# EAGLE design right_revision2_0 (EAGLE 7.2.0)
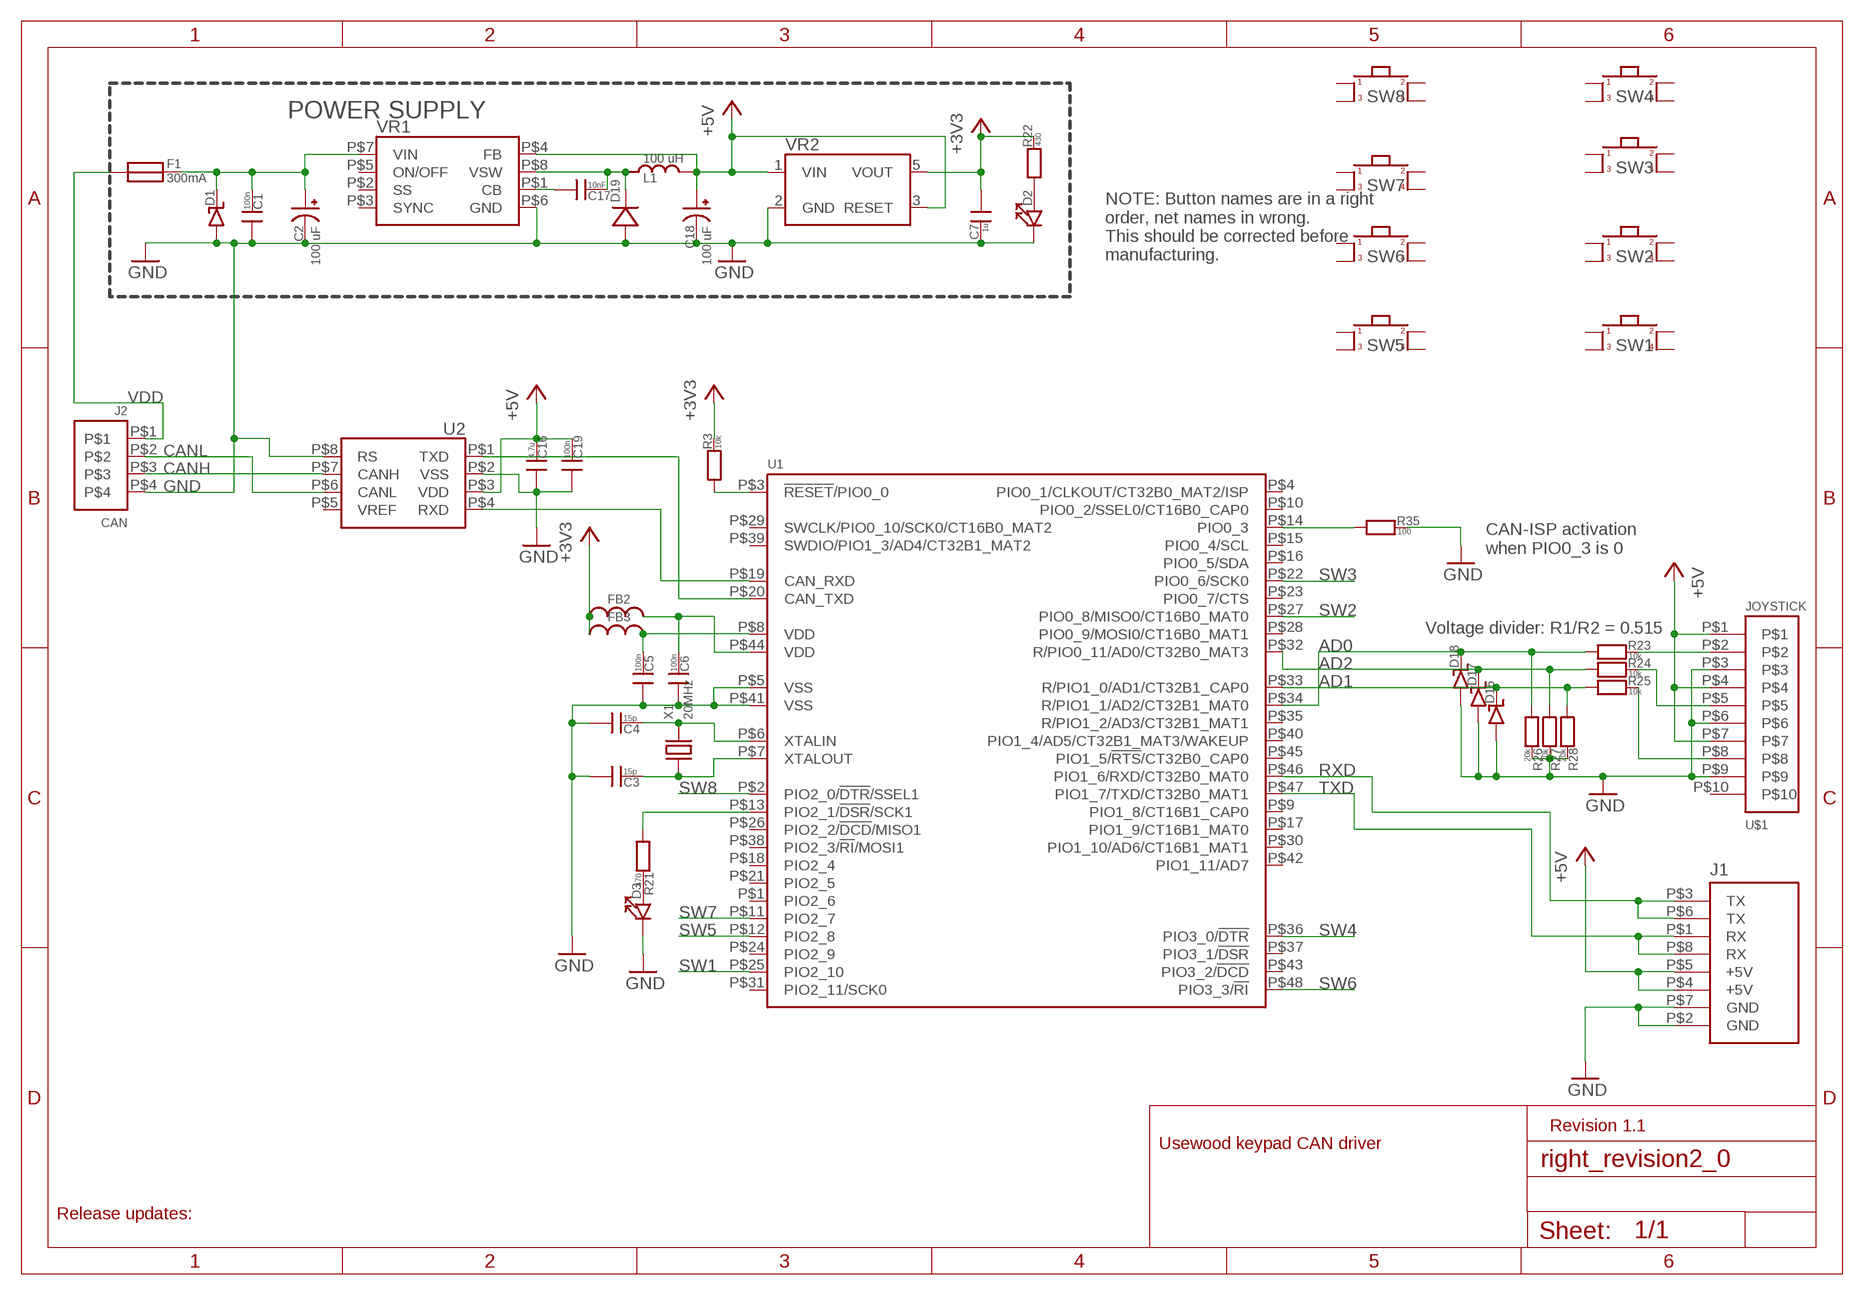
[diagram p0: schematic, sheet 1]

## Parts
C1  100n  CAP0603_SILKSCREEN  [0603_SILKSCREEN]
C2  100 uF  CAP_POLSMD_10X10X10MM  [CAP_POL_SMD_10X10X10MM]
C3  15p  CAP0603_SILKSCREEN  [0603_SILKSCREEN]
C4  15p  CAP0603_SILKSCREEN  [0603_SILKSCREEN]
C5  100n  CAP0603_SILKSCREEN  [0603_SILKSCREEN]
C6  100n  CAP0603_SILKSCREEN  [0603_SILKSCREEN]
C7  1u  CAP0603_SILKSCREEN  [0603_SILKSCREEN]
C16  4.7u  CAP0603_SILKSCREEN  [0603_SILKSCREEN]
C17  10nF  CAP0603_SILKSCREEN  [0603_SILKSCREEN]
C18  100 uF  CAP_POLSMD_10X10X10MM  [CAP_POL_SMD_10X10X10MM]
C19  100n  CAP0603_SILKSCREEN  [0603_SILKSCREEN]
D1  DIODE_TVSDO-214AA  [DO-214AB]
D2  LED0603_SILKSCREEN  [0603_SILKSCREEN]
D3  LED0603_SILKSCREEN  [0603_SILKSCREEN]
D16  DIODE_ZENERSDO123  [SOD123]
D17  DIODE_ZENERSDO123  [SOD123]
D18  DIODE_ZENERSDO123  [SOD123]
D19  DIODEDO219AB  [DO219AB]
F1  300mA  FUSE100MA  [FUSE_100MA]
FB2  FERRITE0603_SILKSCREEN  [0603_SILKSCREEN]
FB3  FERRITE0603_SILKSCREEN  [0603_SILKSCREEN]
J1  HEADER_USART_2_TH  [HEADER_USART_2_TH]
J2  CAN  MOLEX_MICRO-FIT_4WAYTH  [MOLEX_MICRO-FIT_4WAY]
L1  100 uH  INDUCTORBOURNS_10X13X5MM  [INDUCTOR_BOURNS_10X13X5MM]
R3  10k  RES0604_SILKSCREEN  [0603_SILKSCREEN]
R21  470  RES0604_SILKSCREEN  [0603_SILKSCREEN]
R22  430  RES0604_SILKSCREEN  [0603_SILKSCREEN]
R23  10k  RES0604_SILKSCREEN  [0603_SILKSCREEN]
R24  10k  RES0604_SILKSCREEN  [0603_SILKSCREEN]
R25  10k  RES0604_SILKSCREEN  [0603_SILKSCREEN]
R26  20k  RES0604_SILKSCREEN  [0603_SILKSCREEN]
R27  20k  RES0604_SILKSCREEN  [0603_SILKSCREEN]
R28  20k  RES0604_SILKSCREEN  [0603_SILKSCREEN]
R35  100  RES0604_SILKSCREEN  [0603_SILKSCREEN]
SW1  SWITCH_EVQP6L  [SWITCH_EVQ9P6B40]
SW2  SWITCH_EVQP6L  [SWITCH_EVQ9P6B40]
SW3  SWITCH_EVQP6L  [SWITCH_EVQ9P6B40]
SW4  SWITCH_EVQP6L  [SWITCH_EVQ9P6B40]
SW5  SWITCH_EVQP6L  [SWITCH_EVQ9P6B40]
SW6  SWITCH_EVQP6L  [SWITCH_EVQ9P6B40]
SW7  SWITCH_EVQP6L  [SWITCH_EVQ9P6B40]
SW8  SWITCH_EVQP6L  [SWITCH_EVQ9P6B40]
U1  LPC11C14_QFP48  [QFP48]
U2  MCP2551_SOIC8  [SOIC8]
U$1  JOYSTICK  MOLEX_MICRO-FIT_10WAYTH  [MOLEX-MICRO-FIT_10WAY]
VR1  LM2671SOIC8  [SOIC8]
VR2  LP2985SOP5  [SOP5]
X1  20MHz  XTALSMD_5X3.2  [XTAL_SMD_5X3.2]

## Nets
+3V3: C7.0 FB2.0 FB3.0 R3.1 R22.1 VR2.5(VOUT)
+5V: C16.1 C18.+ C19.1 J1.P$4(+5V) J1.P$5(+5V) L1.P$2 U2.P$3(VDD) U$1.P$1 U$1.P$4 U$1.P$7 VR1.P$4(FB) VR2.1(VIN) VR2.3(RESET)
AD0: D18.P$2(N) R23.0 R26.0 U1.P$34(R/PIO1_1/AD2/CT32B1_MAT0)
AD1: D16.P$2(N) R25.0 R28.0 U1.P$33(R/PIO1_0/AD1/CT32B1_CAP0)
AD2: D17.P$2(N) R24.0 R27.0 U1.P$32(R/PIO0_11/AD0/CT32B0_MAT3)
CAN_ISP: R35.0 U1.P$14(PIO0_3)
CANH: J2.P$3 U2.P$7(CANH)
CANL: J2.P$2 U2.P$6(CANL)
GND: C1.0 C2.- C3.0 C4.0 C5.0 C6.0 C7.1 C16.0 C18.- C19.0 D1.P$1(P) D2.1 D3.1 D16.P$1(P) D17.P$1(P) D18.P$1(P) D19.P$1(P) J1.P$2(GND) J1.P$7(GND) J2.P$4 R26.1 R27.1 R28.1 R35.1 U1.P$5(VSS) U1.P$41(VSS) U2.P$2(VSS) U2.P$8(RS) U$1.P$3 U$1.P$6 U$1.P$9 VR1.P$6(GND) VR2.2(GND)
LED3: D3.0 R21.1
N$1: C1.1 C2.+ D1.P$2(N) F1.P$2 VR1.P$7(VIN)
N$2: C6.1 FB2.1 U1.P$44(VDD)
N$3: D2.0 R22.0
N$4: C17.1 D19.P$2(N) L1.P$1 VR1.P$8(VSW)
N$5: R21.0 U1.P$13(PIO2_1/!DSR!/SCK1)
N$20: U1.P$20(CAN_TXD) U2.P$1(TXD)
N$21: U1.P$19(CAN_RXD) U2.P$4(RXD)
N$26: C5.1 FB3.1 U1.P$8(VDD)
N$27: C17.0 VR1.P$1(CB)
N$28: C3.1 U1.P$7(XTALOUT) X1.P$1
RESET: R3.0 U1.P$3(!RESET!/PIO0_0)
RXD: J1.P$3(TX) J1.P$6(TX) U1.P$46(PIO1_6/RXD/CT32B0_MAT0)
SW1: U1.P$25(PIO2_10)
SW2: U1.P$27(PIO0_8/MISO0/CT16B0_MAT0)
SW3: U1.P$22(PIO0_6/SCK0)
SW4: U1.P$36(PIO3_0/!DTR)
SW5: U1.P$12(PIO2_8)
SW6: U1.P$48(PIO3_3/!RI)
SW7: U1.P$11(PIO2_7)
SW8: U1.P$2(PIO2_0/!DTR!/SSEL1)
TXD: J1.P$1(RX) J1.P$8(RX) U1.P$47(PIO1_7/TXD/CT32B0_MAT1)
VDD: F1.P$1 J2.P$1
XJOY: R23.1 U$1.P$2
XTALIN: C4.1 U1.P$6(XTALIN) X1.P$2
YJOY: R24.1 U$1.P$5
ZJOY: R25.1 U$1.P$8
Unconnected: SW1.A SW1.A' SW1.B SW1.B' SW2.A SW2.A' SW2.B SW2.B' SW3.A SW3.A' SW3.B SW3.B' SW4.A SW4.A' SW4.B SW4.B' SW5.A SW5.A' SW5.B SW5.B' SW6.A SW6.A' SW6.B SW6.B' SW7.A SW7.A' SW7.B SW7.B' SW8.A SW8.A' SW8.B SW8.B' U1.P$1(PIO2_6) U1.P$4(PIO0_1/CLKOUT/CT32B0_MAT2/ISP) U1.P$9(PIO1_8/CT16B1_CAP0) U1.P$10(PIO0_2/SSEL0/CT16B0_CAP0) U1.P$15(PIO0_4/SCL) U1.P$16(PIO0_5/SDA) U1.P$17(PIO1_9/CT16B1_MAT0) U1.P$18(PIO2_4) U1.P$21(PIO2_5) U1.P$23(PIO0_7/CTS) U1.P$24(PIO2_9) U1.P$26(PIO2_2/!DCD!/MISO1) U1.P$28(PIO0_9/MOSI0/CT16B0_MAT1) U1.P$29(SWCLK/PIO0_10/SCK0/CT16B0_MAT2) U1.P$30(PIO1_10/AD6/CT16B1_MAT1) U1.P$31(PIO2_11/SCK0) U1.P$35(R/PIO1_2/AD3/CT32B1_MAT1) U1.P$37(PIO3_1/!DSR) U1.P$38(PIO2_3/!RI!/MOSI1) U1.P$39(SWDIO/PIO1_3/AD4/CT32B1_MAT2) U1.P$40(PIO1_4/AD5/CT32B1_MAT3/WAKEUP) U1.P$42(PIO1_11/AD7) U1.P$43(PIO3_2/!DCD) U1.P$45(PIO1_5/!RTS!/CT32B0_CAP0) U2.P$5(VREF) U$1.P$10 VR1.P$2(SS) VR1.P$3(SYNC) VR1.P$5(ON/OFF)

## Notes on the sheet
- POWER SUPPLY
- NOTE: Button names are in a right 
  order, net names in wrong.
  This should be corrected before
  manufacturing.
- CAN-ISP activation 
  when PIO0_3 is 0
- Voltage divider: R1/R2 = 0.515
- Revision 1.1
- Usewood keypad CAN driver
- Release updates:

## Library data of the parts
C1 C3-C7 C16 C17 C19 = usevolt:CAP
C2 C18 = usevolt:CAP_POL
D1 = arm:DIODE_TVS: 9886257 STMICROELECTRONICS SMBJ33A-TR Product Range:Transil SMBJ Series; TVS Polarity:Unidirectional; Reverse Stand-Off Voltage Vrwm:33V; Diode Case Style:DO-214AA; No. of Pins:2; Breakdown Voltage Min:36.7V; Breakdown Voltage Max:38.6 http://fi.farnell.com/webapp/wcs/stores/servlet/ProductDisplay?catalogId=15001&langId=358&urlRequestType=Base&partNumber=9886257&storeId=10159
D2 D3 = usevolt:LED
D16-D18 = usevolt:DIODE_ZENER
D19 = usevolt:DIODE
F1 = arm:FUSE: *** 100 mA *** 1861161 MULTICOMP MC36204 Holding Current:100mA; Tripping Current:300mA; Carrying Current Max:10A; Initial Resistance Max:15ohm; Operating Voltage:60VDC; PTC Fuse Case Style:SMD; Current Max:10A; External Depth:3 http://fi.farnell.com/webapp/wcs/stores/servlet/ProductDisplay?catalogId=15001&langId=358&urlRequestType=Base&partNumber=1861161&storeId=10159
FB2 FB3 = usevolt:FERRITE
J1 = usevolt:HEADER_USART_2
J2 = arm:MOLEX_MICRO-FIT_4WAY: MOLEX 43045-0401 HEADER, RIGHT ANGLE, DUAL ROW, 4 WAY, 1704306 Product Range:Micro-Fit 3.0 43045 Series; Pitch Spacing:3mm; Contact Termination Type:Through Hole; No. of Contacts:4; No. of Rows:2; Connector Mounting:PCB; Gender:Header; Contact M http://fi.farnell.com/webapp/wcs/stores/servlet/ProductDisplay?catalogId=15001&langId=358&urlRequestType=Base&partNumber=1704306&storeId=10159
L1 = usevolt:INDUCTOR
R3 R21-R28 R35 = usevolt:RES
SW1-SW8 = usevolt:SWITCH_EVQP6L: http://www.farnell.com/datasheets/1679727.pdf PANASONIC ELECTRONIC COMPONENTS EVQ9P6B40 SWITCH, 4X4MM, 2.4N Lisää suosikkeihin Huomasitko virheen? Tulosta sivu PANASONIC ELECTRONIC COMPONENTS EVQ9P6B40 Suurenna napsauttamalla Kuva on vain kuvaavaa tarkoitusta varten. Lue tuotekuvaus tarkempia tietoja varten. PANASONIC ELECTRONIC COMPONENTS Valmistaja PANASONIC ELECTRONIC COMPONENTS Tilauskoodi: 2079573 Valmistajan osanumero EVQ9P6B40 Technical Data Sheet (124.82KB) EN Tuotetiedot, asiakirjat ja muuta Contact Current Max: 20mA Contact Voltage DC Nom: 15V Illumination: Non Illuminated Operating Force: 2.4N Product Range: - SVHC: No SVHC (15-Jun-2015) Switch Terminals: Solder; FARNELL_ID: 2079541; MANUFACTURER_ID: EVQ-P6LB55; MOUSER_ID: 667-EVQ-P6LB55
U1 = usevolt:LPC11C14
U2 = usevolt:MCP2551: Microchip High-Speed CAN Transceiver Supports 1 Mb/s operation • Implements ISO-11898 standard physical layer requirements • Suitable for 12V and 24V systems • Externally-controlled slope for reduced RFI emissions • Detection of ground fault (permanent dominant) on TXD input • Power-on reset and voltage brown-out protection • An unpowered node or brown-out event will not disturb the CAN bus • Low current standby operation • Protection against damage due to short-circuit conditions (positive or negative battery voltage) • Protection against high-voltage transients • Automatic thermal shutdown protection • Up to 112 nodes can be connected • High noise immunity due to differential bus implementation • Temperature ranges: - Industrial (I): -40°C to +85°C - Extended (E): -40°C to +125°C http://www.digikey.com/product-detail/en/MCP2551T-E%2FSN/MCP2551T-E%2FSNCT-ND/4307904 http://ww1.microchip.com/downloads/en/DeviceDoc/21667f.pdf http://www.farnell.com/datasheets/657417.pdf http://fi.farnell.com/microchip/mcp2551-i-sn/ic-can-transceiver-hi-speed-smd/dp/9758569
U$1 = usevolt:MOLEX_MICRO-FIT_10WAY: MOLEX HEADER, MICRO-FIT, R/A, DUAL ROW, 10 WAY, 1012255
VR1 = usevolt:LM2671: TEXAS INSTRUMENTS LM2671MX-5.0/NOPB IC, STEP-DOWN REGULATOR, SOIC-8 http://www.farnell.com/datasheets/1874686.pdf
VR2 = arm:LP2985: TEXAS INSTRUMENTS LP2985IM5-3.3 V REG LDO +3.3V, SMD, 2985, SOT235 http://www.farnell.com/datasheets/1882537.pdf
X1 = arm:XTAL

## Board
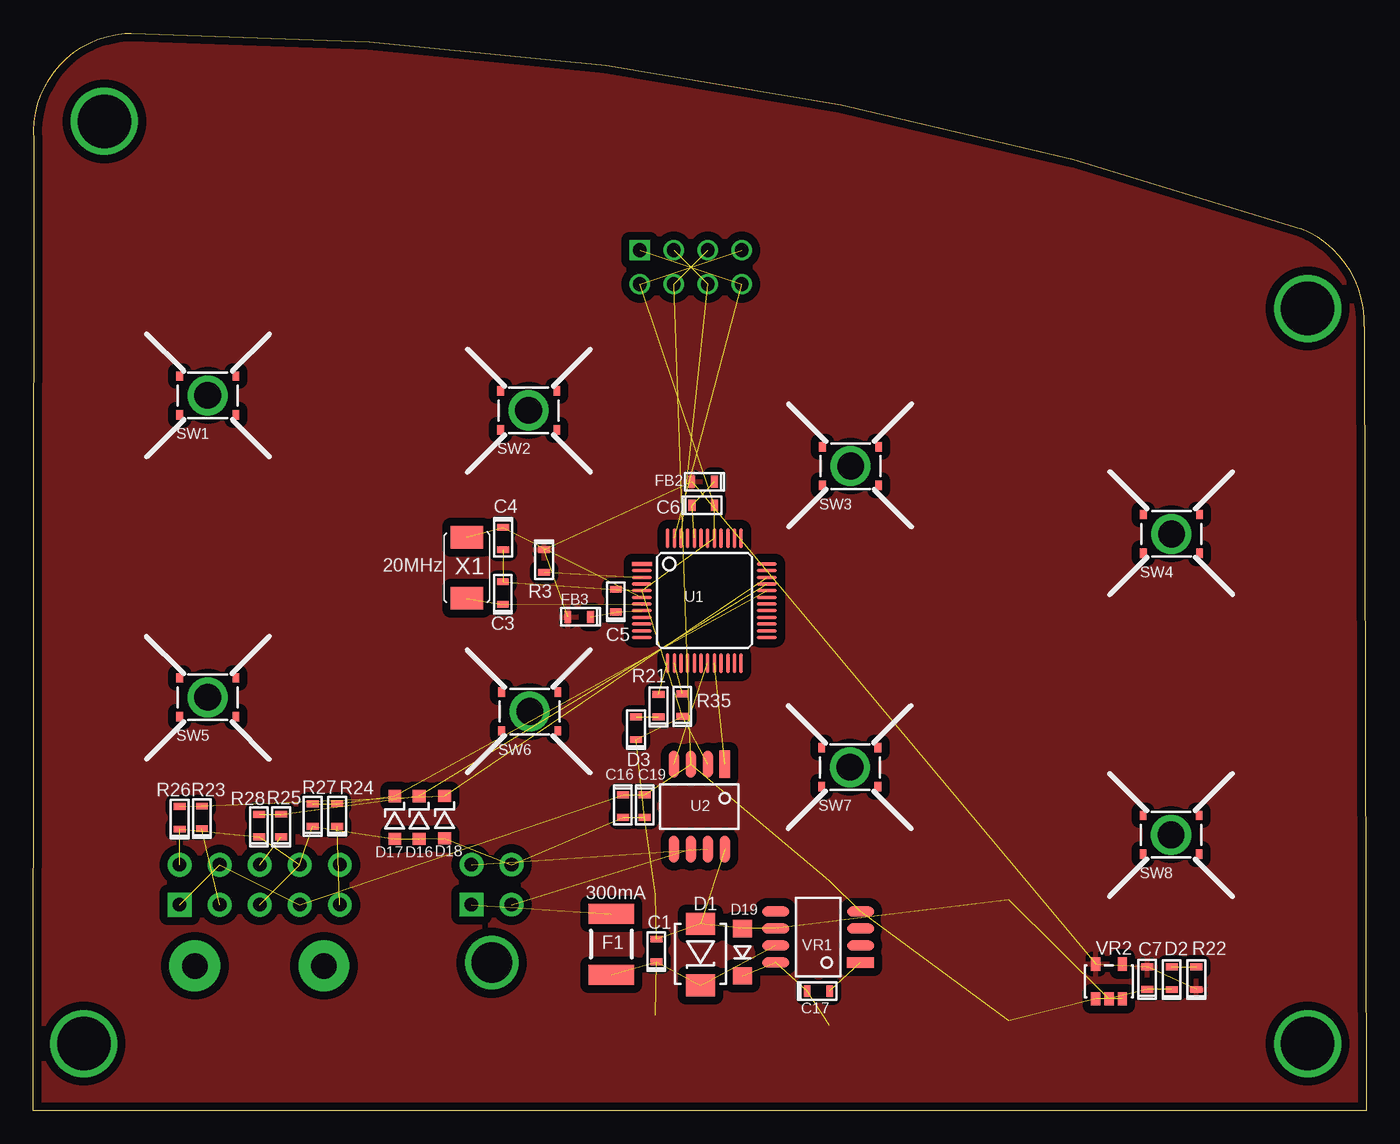
[diagram p1: board, top side]
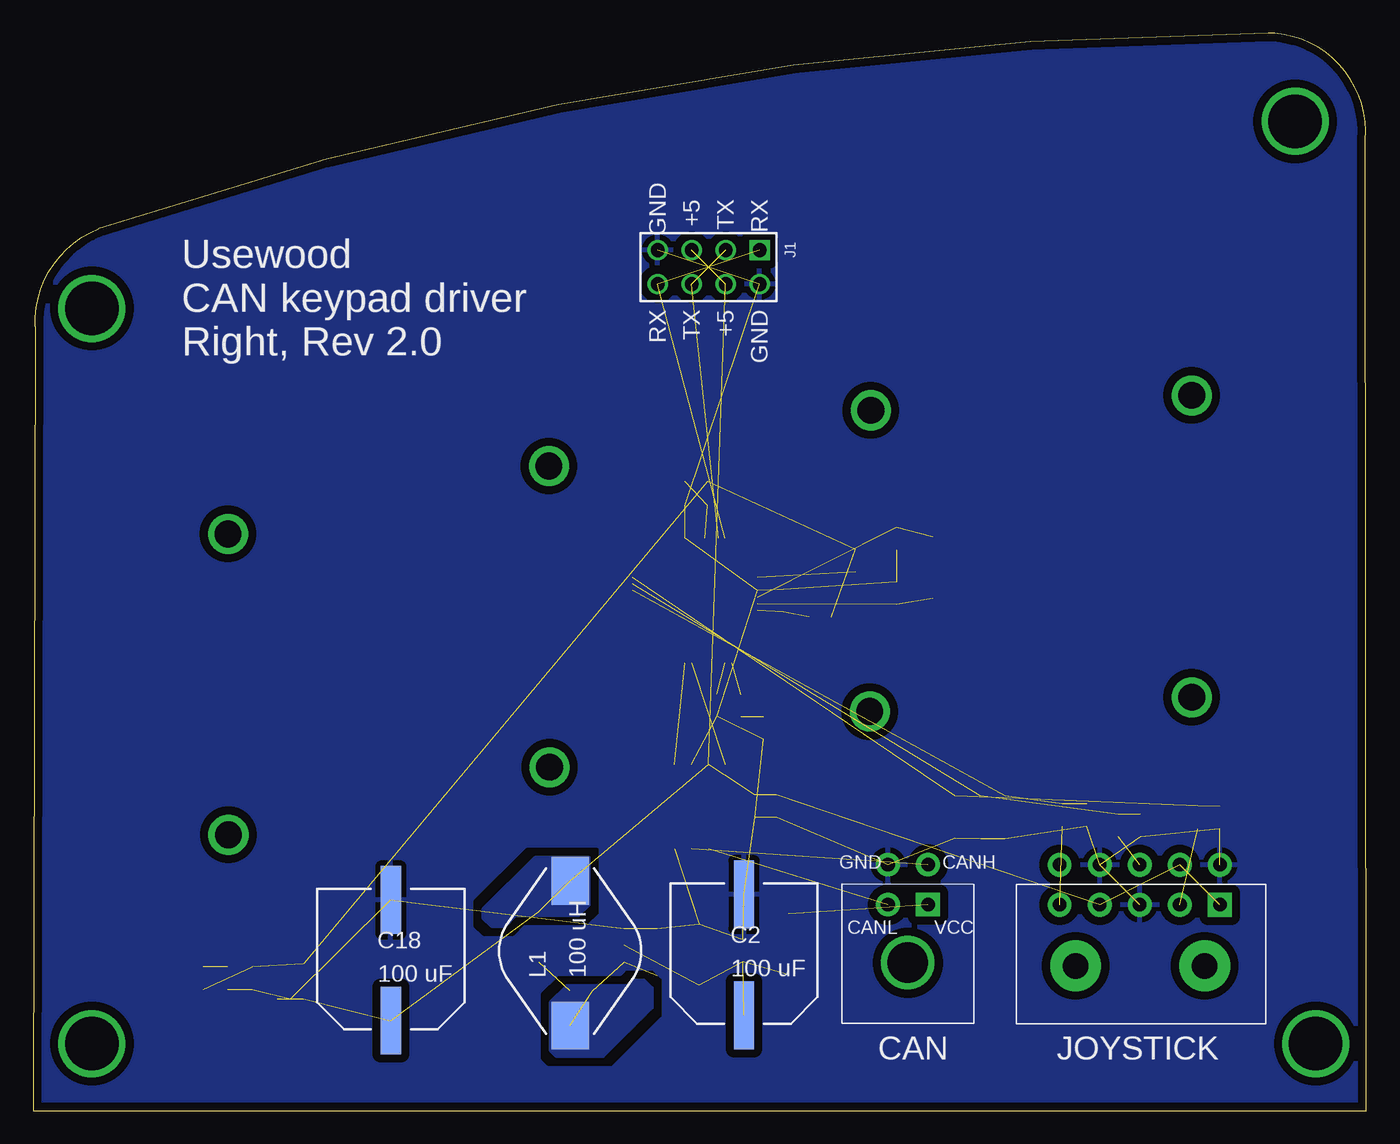
[diagram p2: board, bottom side, seen from below]

Size 99.68 x 80.58 mm. Coordinates in mm from the lower left corner, seen from the top.
Outline: 0,0 0.05,72.6 arc-90 6.81,80.58 7.31,80.58 arc-19 94.8,65.97 arc-71 99.54,58.64 99.68,0 0,0
Copper layers (1*16): Top 0.035mm / dielectric 1.5mm / Bottom 0.035mm
Design rules "SeeedStudio_2layer_DRU_no_angle_20140221 *": minimum track width 6mil, minimum drill 12mil, track to track 6mil, track to pad 6mil, pad to pad 6mil, via to via 6mil, smd to smd 0mil, copper to edge 10mil, drill to drill 10mil, minimum pad ring 10mil, minimum via ring 6mil, stop-mask expansion 2mil, vias tented up to drill 100mil, thermal gap 16mil

### Footprints (pad centres in the part's own frame; a part is rotated, then mirrored left to right if it is on the bottom)
0603_SILKSCREEN = smd 0.508 x 0.889: 0 -1.041,0; 1 0.648,0
CAP_POL_SMD_10X10X10MM = smd 1.5 x 5.08: + 0,0.635; - 0,9.665
DO-214AB = smd 1.62 x 2.18: P$1 0,0; P$2 4.6,0
SOD123 = smd 0.9 x 0.95: P$1 0,0; P$2 3.2,0
DO219AB = smd 1.3 x 1.4: P$1 0,0; P$2 3.535,0
FUSE_100MA = smd 1.5 x 3.41: P$1 0,0; P$2 4.572,0
HEADER_USART_2_TH = drill 1.016 square: P$1 1.27,8.89 | drill 1.016: P$2 3.81,8.89; P$3 1.27,6.35; P$4 3.81,6.35; P$5 1.27,3.81; P$6 3.81,3.81; P$7 1.27,1.27; P$8 3.81,1.27
MOLEX_MICRO-FIT_4WAY = drill 1.016 pad 1.778 square: P$1 1.27,2.032 | drill 1.016 pad 1.778: P$2 -1.727,2.032; P$3 1.27,5.029; P$4 -1.727,5.029 | drill 3: P$5 -0.25,-2.3
INDUCTOR_BOURNS_10X13X5MM = smd 3.556 x 2.8: P$1 -1.754,0; P$2 9.054,0
SWITCH_EVQ9P6B40 = smd 0.5 x 0.7: A 0.25,-0.35; A' 4.45,-0.35; B 0.25,-3.25; B' 4.45,-3.25 | drill 2 pad 2: P$1 2.35,-1.8
QFP48 = smd 1.5 x 0.28: P$1 0.2,0; P$2 0.2,-0.5; P$3 0.2,-1; P$4 0.2,-1.5; P$5 0.2,-2; P$6 0.2,-2.5; P$7 0.2,-3; P$8 0.2,-3.5; P$9 0.2,-4; P$10 0.2,-4.5; P$11 0.2,-5; P$12 0.2,-5.5; P$25 9.55,-5.5; P$26 9.55,-5; P$27 9.55,-4.5; P$28 9.55,-4; P$29 9.55,-3.5; P$30 9.55,-3; P$31 9.55,-2.5; P$32 9.55,-2; P$33 9.55,-1.5; P$34 9.55,-1; P$35 9.55,-0.5; P$36 9.55,0 | smd 0.28 x 1.5: P$13 2.125,-7.425; P$14 2.625,-7.425; P$15 3.125,-7.425; P$16 3.625,-7.425; P$17 4.125,-7.425; P$18 4.625,-7.425; P$19 5.125,-7.425; P$20 5.625,-7.425; P$21 6.125,-7.425; P$22 6.625,-7.425; P$23 7.125,-7.425; P$24 7.625,-7.425; P$37 7.625,1.925; P$38 7.125,1.925; P$39 6.625,1.925; P$40 6.125,1.925; P$41 5.625,1.925; P$42 5.125,1.925; P$43 4.625,1.925; P$44 4.125,1.925; P$45 3.625,1.925; P$46 3.125,1.925; P$47 2.625,1.925; P$48 2.125,1.925
SOIC8 = smd 2.032 x 0.762: P$1 -2.54,2.54; P$2 -2.54,1.27; P$3 -2.54,0; P$4 -2.54,-1.27; P$5 3.81,-1.27; P$6 3.81,0; P$7 3.81,1.27; P$8 3.81,2.54
MOLEX-MICRO-FIT_10WAY = drill 1.016 pad 1.778 square: P$1 0,-0.508 | drill 1.016 pad 1.778: P$2 -2.997,-0.508; P$3 -5.994,-0.508; P$4 -8.992,-0.508; P$5 -11.989,-0.508; P$6 0,2.489; P$7 -2.997,2.489; P$8 -5.994,2.489; P$9 -8.992,2.489; P$10 -11.989,2.489 | drill 1.905 pad 3.81: P$11 -10.795,-5.08; P$12 -1.143,-5.08
SOP5 = smd 0.7 x 1: 1 -1,0; 2 0,0; 3 1,0; 4 1,2.6; 5 -1,2.6
XTAL_SMD_5X3.2 = smd 1.7 x 2.4: P$1 -2.286,0; P$2 2.286,0

### Placement (x,y rotation side)
C1  46.6,11.78 270 top
C2  46.53,6.5 0 bottom
C3  35.12,38.52 270 top
C4  35.13,42.99 90 top
C5  43.56,37.95 270 top
C6  49.91,45.28 180 top
C7  83.31,9.71 270 top
C16  44.09,22.96 90 top
C17  58.52,8.94 180 top
C18  72.95,6.1 0 bottom
C19  45.72,22.96 90 top
D1  49.9,13.97 270 top
D2  85.14,9.7 270 top
D3  45.07,28.4 270 top
D16  28.85,20.32 90 top
D17  27.03,20.32 90 top
D18  30.76,20.35 90 top
D19  53.04,13.61 270 top
F1  43.22,14.73 270 top
FB2  50.29,47.04 0 top
FB3  41.02,36.93 0 top
J1  54.25,65.63 270 bottom
J2  34.04,13.37 0 bottom
L1  59.54,8.13 90 bottom
R3  38.19,41.31 90 top
R21  46.75,30.09 270 top
R22  86.98,9.7 270 top
R23  12.6,21.74 270 top
R24  22.72,21.91 270 top
R25  18.53,21.13 270 top
R26  10.94,21.7 270 top
R27  20.88,21.91 270 top
R28  16.88,21.12 270 top
R35  48.54,30.13 270 top
SW1  10.69,55.3 0 top
SW2  34.7,54.18 0 top
SW3  58.78,50.01 0 top
SW4  82.78,44.93 0 top
SW5  10.69,32.72 0 top
SW6  34.77,31.65 0 top
SW7  58.72,27.48 0 top
SW8  82.75,22.43 0 top
U1  45.31,40.89 0 top
U2  49.17,23.37 270 top
U$1  10.93,15.9 0 bottom
VR1  59.33,13.61 180 top
VR2  80.46,8.36 0 top
X1  32.42,40.61 90 top

### Tracks (layer width: path | path; a pad name or v marks a point on that pad's centre or on a via)
+3V3  (5 unrouted)
  pour Top (isolate 0.61): 99.68,0 98.83,55.38 arc41 98.87,61.57 arc28 95.09,65.57 arc9 87.31,68.37 arc-1 70.51,73.18 arc5 53.71,76.78 arc6 25.71,79.98 arc3 8.91,80.58 arc1 6.51,80.58 arc15 5.11,80.38 arc5 2.71,79.58 arc27 0.11,77.78 arc39 0.15,72.8 0,0
+5V  (12 unrouted)
  pour Bottom (isolate 0.508, no thermals): 66.04,15.04 66.04,14.43 65.43,13.82 64.41,13.82 63.6,14.63 58.93,14.63 58.12,15.44 58.12,18.9 62.18,18.9
AD0  (3 unrouted)
AD1  (3 unrouted)
AD2  (3 unrouted)
CAN_ISP  (1 unrouted)
CANH  (1 unrouted)
CANL  (1 unrouted)
GND  (32 unrouted)
  pour Bottom (isolate 0.61, rank 2): 99.68,0.2 98.83,55.59 arc41 98.87,61.57 arc28 95.09,65.57 arc9 87.31,68.17 arc-1 70.51,73.38 arc5 53.71,76.98 arc6 25.71,80.18 arc3 8.91,80.78 arc1 6.51,80.78 arc15 5.11,80.58 arc5 2.71,79.78 arc27 0.11,77.98 arc39 0.15,71.58 0,0.2
LED3  (1 unrouted)
N$1  (4 unrouted)
N$2  (2 unrouted)
N$3  (1 unrouted)
N$4  (3 unrouted)
  pour Bottom (isolate 0.508, no thermals): 54.46,9.75 54.05,9.75 53.44,9.14 53.44,7.72 57.1,4.06 60.55,4.06 60.96,4.47 60.96,8.13 59.74,9.35 55.07,9.35 54.66,9.75
N$5  (1 unrouted)
N$7  (via drill 4)
  other vias: 3.76,5
N$8  (via drill 4)
  other vias: 95.31,5
N$9  (via drill 4)
  other vias: 95.31,60
N$10  (via drill 4)
  other vias: 5.31,74
N$20  (1 unrouted)
N$21  (1 unrouted)
N$26  (2 unrouted)
N$27  (1 unrouted)
N$28  (2 unrouted)
RESET  (1 unrouted)
RXD  (2 unrouted)
TXD  (2 unrouted)
VDD  (1 unrouted)
XJOY  (1 unrouted)
XTALIN  (2 unrouted)
YJOY  (1 unrouted)
ZJOY  (1 unrouted)

### Text on the board
bPlace: Usewood / CAN keypad driver / Right, Rev 2.0 | CANH | GND | VCC | CANL | JOYSTICK | CAN